# Altium schematic sheet Board.SchDoc: SLEFIE_ON_BOARD_COMPUTER
size A2
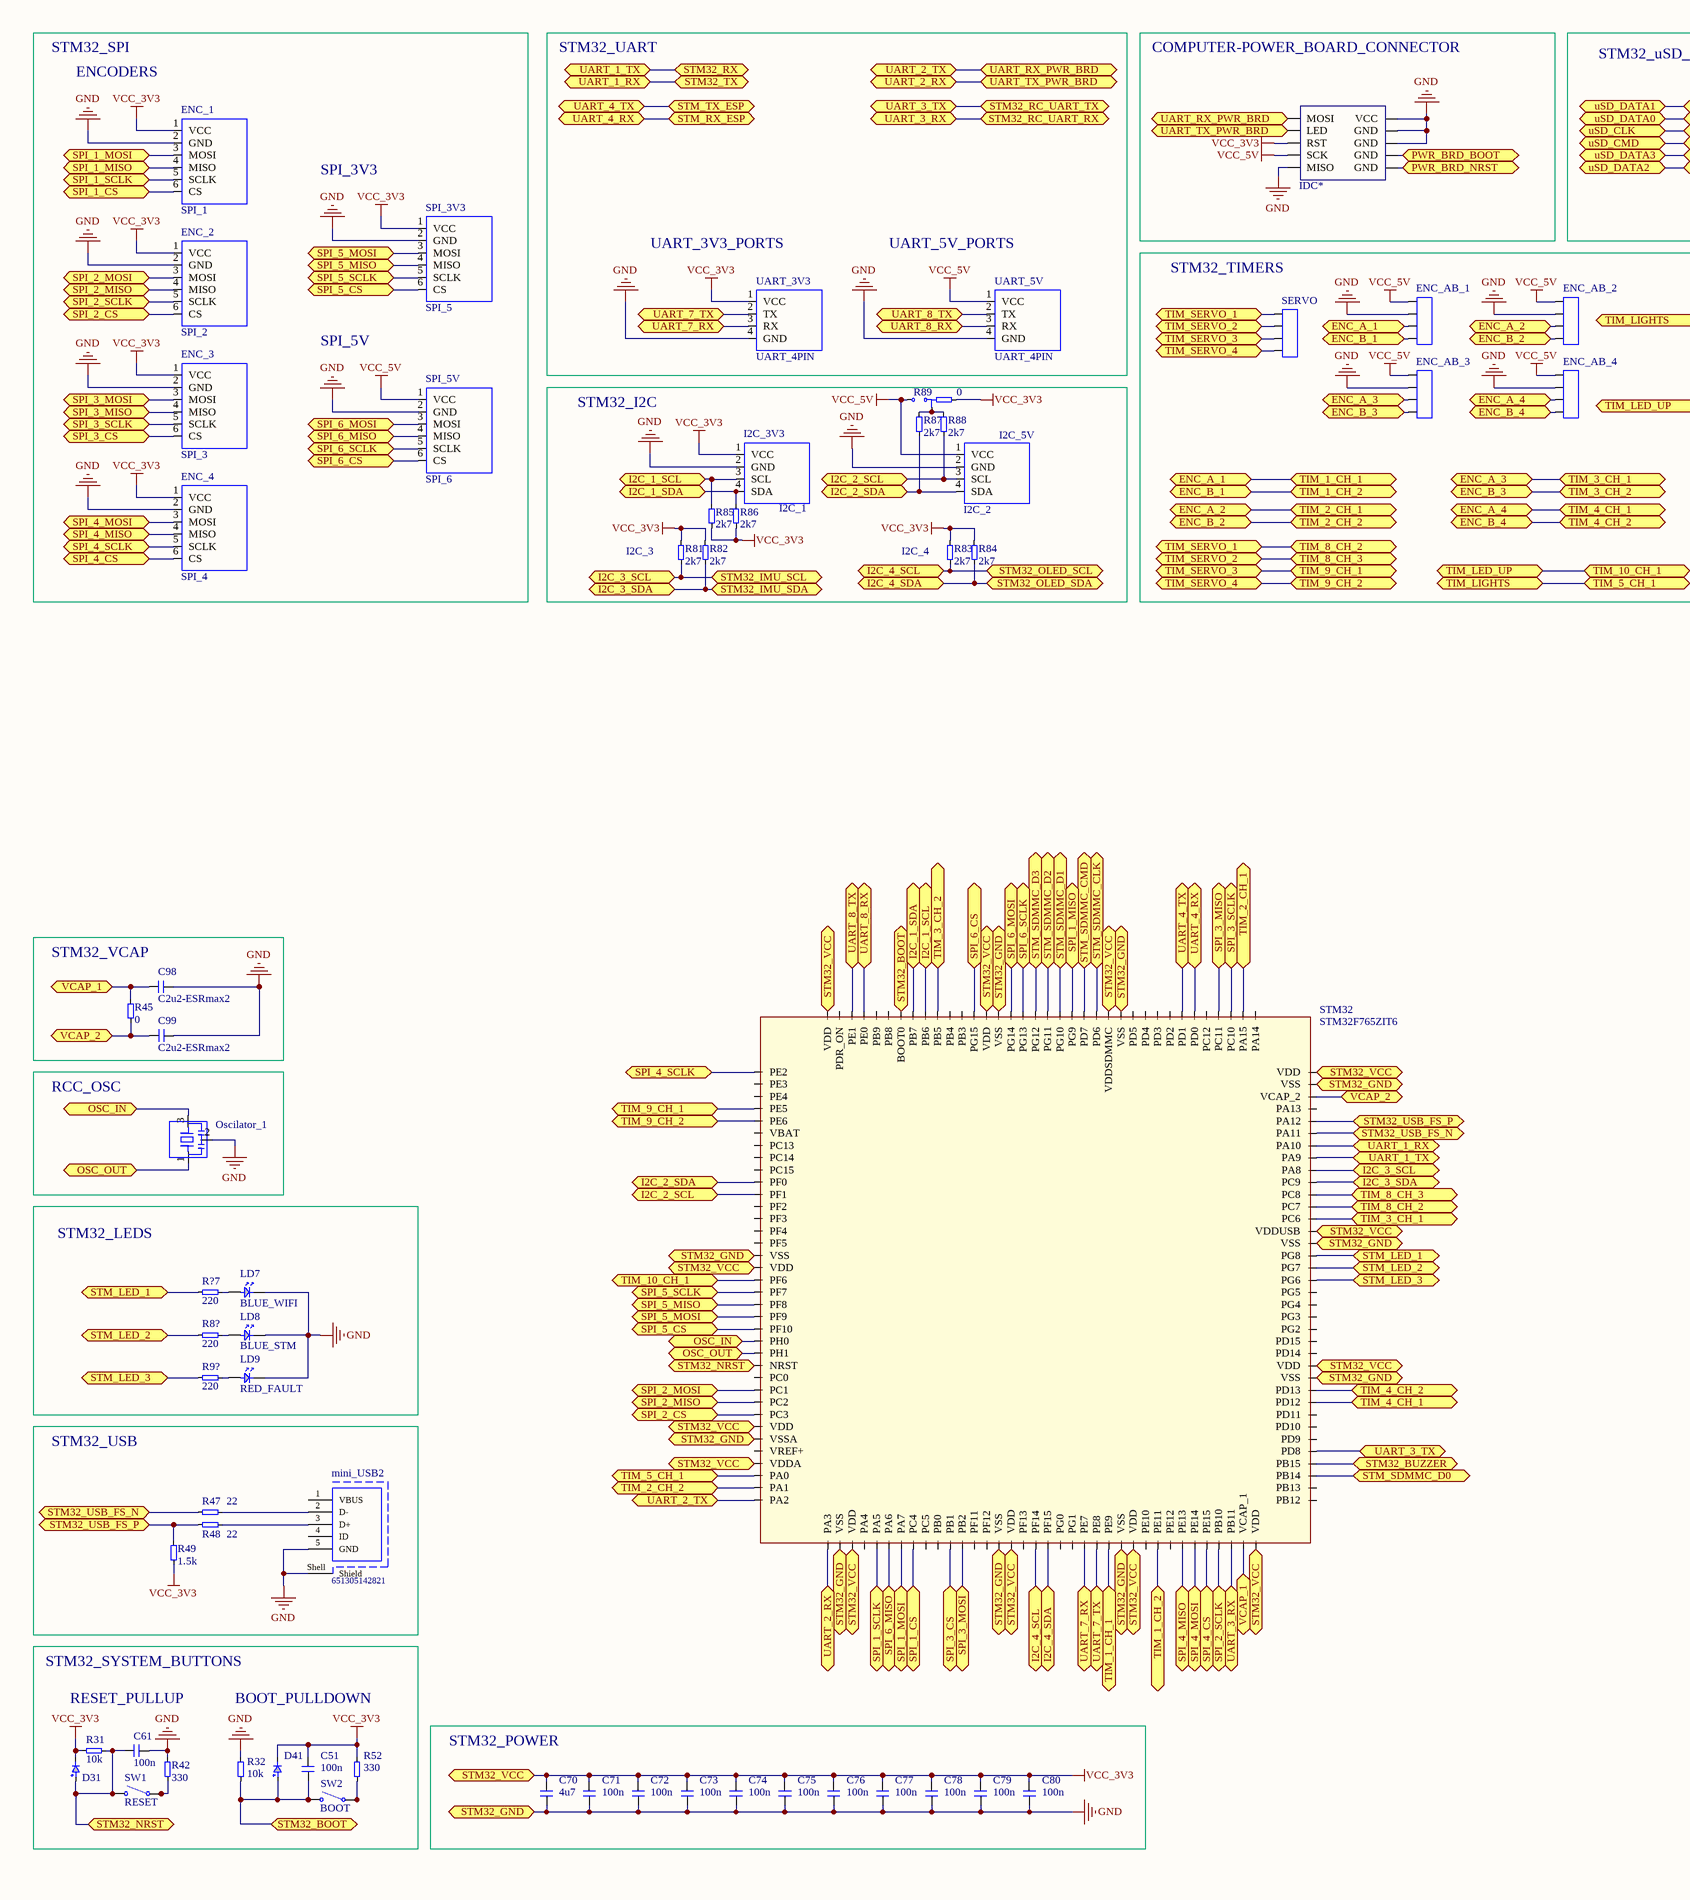
[diagram p0: Board.SchDoc, left]
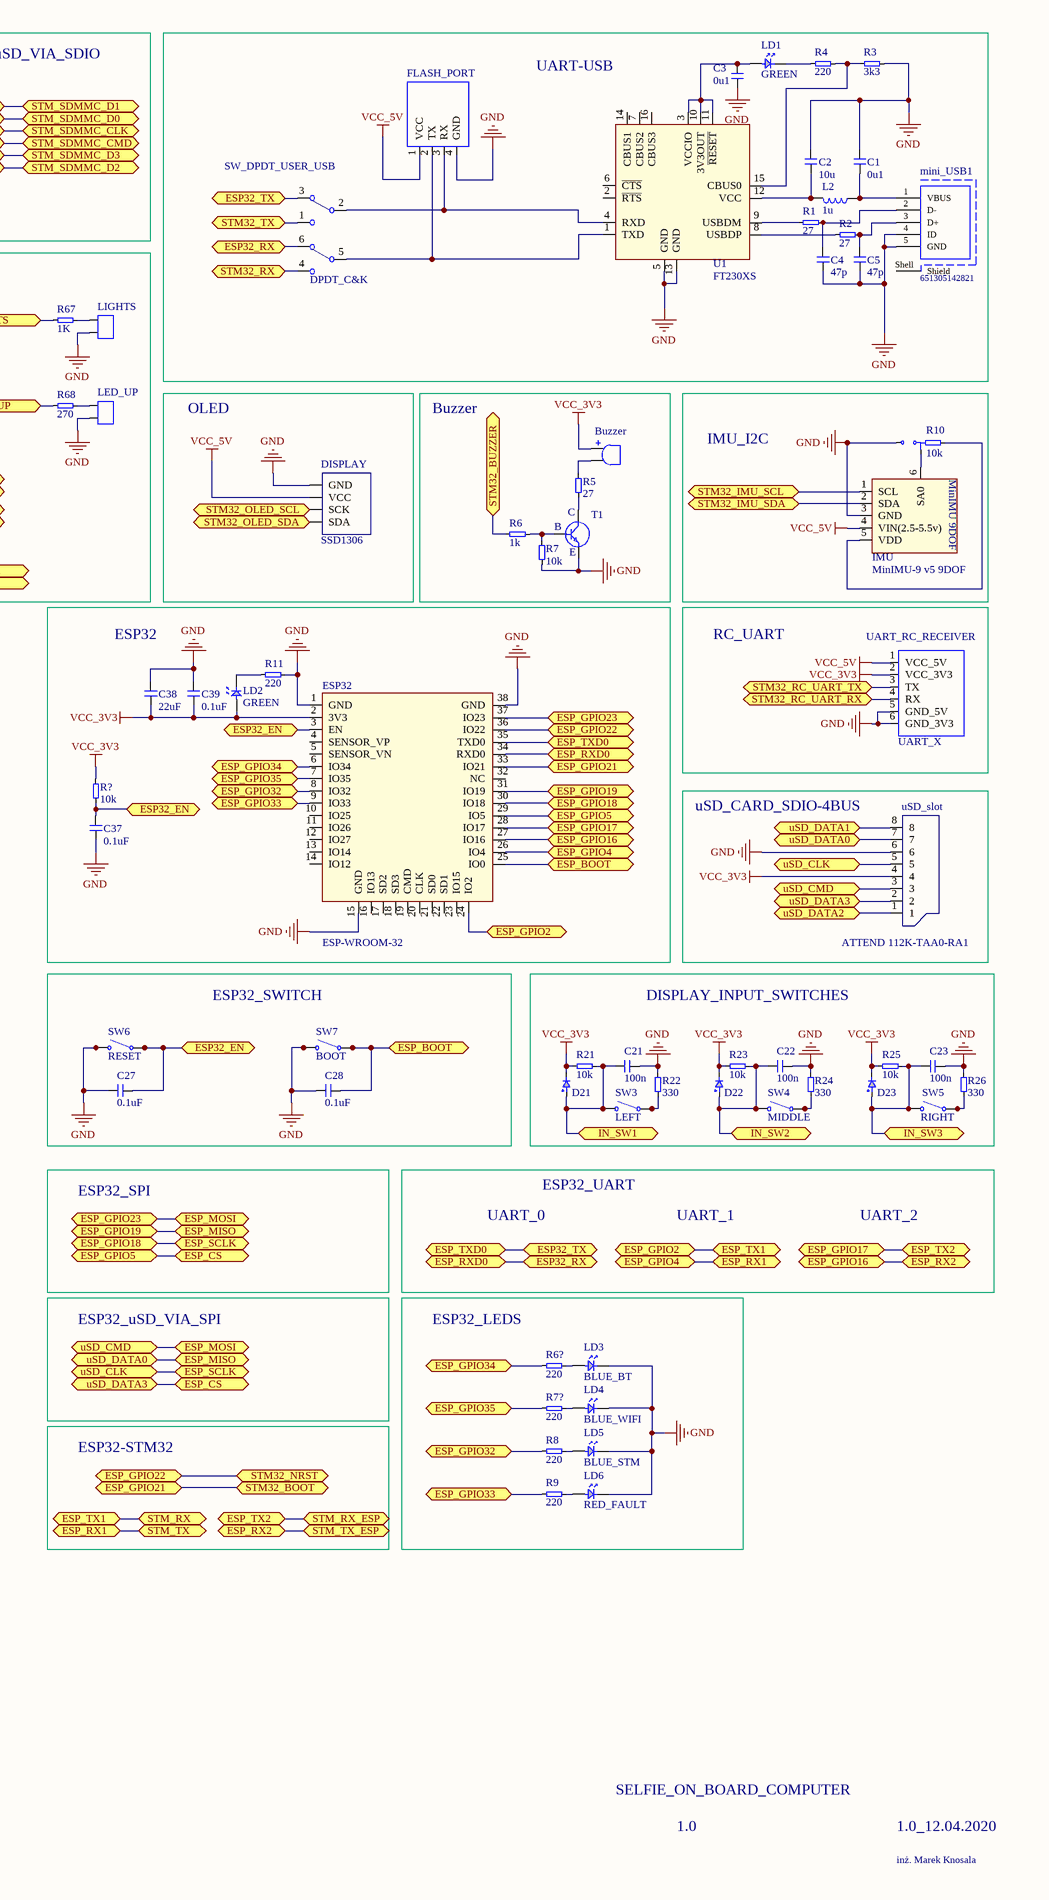
[diagram p1: Board.SchDoc, right]

## Parts
Buzzer  magnectic_buzzer  [SMT-0540-S-R]  (value not drawn)
C1  0u1  [0603]
C2  10u  [0603]
C3  0u1  [0603]
C4  47p  [0603]
C5  47p  [0603]
C21  100n  [0603]
C22  100n  [0603]
C23  100n  [0603]
C27  0.1uF  [0603]
C28  0.1uF  [0603]
C37  0.1uF  [0603]
C38  22uF  [0603]
C39  0.1uF  [0603]
C51  100n  [0603]
C61  100n  [0603]
C70  4u7  [0603]
C71  100n  [0603]
C72  100n  [0603]
C73  100n  [0603]
C74  100n  [0603]
C75  100n  [0603]
C76  100n  [0603]
C77  100n  [0603]
C78  100n  [0603]
C79  100n  [0603]
C80  100n  [0603]
C98  C2u2-ESRmax2  [0603]
C99  C2u2-ESRmax2  [0603]
D21  diode  [SOD123]  (value not drawn)
D22  diode  [SOD123]  (value not drawn)
D23  diode  [SOD123]  (value not drawn)
D31  diode  [SOD123]  (value not drawn)
D41  diode  [SOD123]  (value not drawn)
DISPLAY  SSD1306  [SSD1306]
ENC_1  SPI_1  [JST SR SH 1.0 - 6PIN]
ENC_2  SPI_2  [JST SR SH 1.0 - 6PIN]
ENC_3  SPI_3  [JST SR SH 1.0 - 6PIN]
ENC_4  SPI_4  [JST SR SH 1.0 - 6PIN]
ENC_AB_1  4 PIN CONNECTOR  [JST SR SH 1.0 - 4PIN]  (value not drawn)
ENC_AB_2  4 PIN CONNECTOR  [JST SR SH 1.0 - 4PIN]  (value not drawn)
ENC_AB_3  4 PIN CONNECTOR  [JST SR SH 1.0 - 4PIN]  (value not drawn)
ENC_AB_4  4 PIN CONNECTOR  [JST SR SH 1.0 - 4PIN]  (value not drawn)
ESP32  ESP-WROOM-32  [ESP-WROOM-32]
FLASH_PORT  UART_1  [JST SR SH 1.0 TOP - 4PIN]  (value not drawn)
I2C_3V3  I2C_1  [JST SR SH 1.0 - 4PIN]
I2C_5V  I2C_2  [JST SR SH 1.0 - 4PIN]
IDC*  IDC  [IDC_10_1.27]  (value not drawn)
IMU  MinIMU-9 v5 9DOF  [MinIMU-9 v5 9DOF - GOLDPINS]
L2  1u  [R0603]
LD1  GREEN  [0603]
LD2  GREEN  [0603]
LD3  BLUE_BT  [0603]
LD4  BLUE_WIFI  [0603]
LD5  BLUE_STM  [0603]
LD6  RED_FAULT  [0603]
LD7  BLUE_WIFI  [0603]
LD8  BLUE_STM  [0603]
LD9  RED_FAULT  [0603]
LED_UP  2 PIN CONNECTOR  [JST SR SH 1.0 - 2pin]  (value not drawn)
LIGHTS  2 PIN CONNECTOR  [JST SR SH 1.0 - 2pin]  (value not drawn)
mini_USB1  651305142821  [651305142821]
mini_USB2  651305142821  [651305142821]
Oscilator_1  CSTCC8M00G53-R0  [CSTCC8M00G53-R0]  (value not drawn)
R1  27  [R0603]
R2  27  [R0603]
R3  3k3  [R0603]
R4  220  [R0603]
R5  27  [R0603]
R6  1k  [R0603]
R6?  220  [R0603]
R7  10k  [R0603]
R7?  220  [R0603]
R8  220  [R0603]
R8?  220  [R0603]
R9  220  [R0603]
R9?  220  [R0603]
R10  10k  [R0603 - double]
R11  220  [R0603]
R21  10k  [R0603]
R22  330  [R0603]
R23  10k  [R0603]
R24  330  [R0603]
R25  10k  [R0603]
R26  330  [R0603]
R31  10k  [R0603]
R32  10k  [R0603]
R42  330  [R0603]
R45  0  [R0603]
R47  22  [R0603]
R48  22  [R0603]
R49  1.5k  [R0603]
R52  330  [R0603]
R67  1K  [R0603]
R68  270  [R0603]
R81  2k7  [R0603]
R82  2k7  [R0603]
R83  2k7  [R0603]
R84  2k7  [R0603]
R85  2k7  [R0603]
R86  2k7  [R0603]
R87  2k7  [R0603]
R88  2k7  [R0603]
R89  0  [R0603 - double]
R?  10k  [R0603]
R?7  220  [R0603]
SERVO  TIMERS  [JST SR SH 1.0 - 4PIN]  (value not drawn)
SPI_3V3  SPI_5  [JST SR SH 1.0 - 6PIN]
SPI_5V  SPI_6  [JST SR SH 1.0 - 6PIN]
STM32  STM32F765ZIT6  [LQFP144]
SW1  RESET  [LSH Gullwing]
SW2  BOOT  [LSH Gullwing]
SW3  LEFT  [LSH Gullwing]
SW4  MIDDLE  [LSH Gullwing]
SW5  RIGHT  [LSH Gullwing]
SW6  RESET  [LSH Gullwing]
SW7  BOOT  [LSH Gullwing]
SW_DPDT_USER_USB  DPDT_C&K  [JS202011SCQN_C&K]
T1  NPN  [SOT23]  (value not drawn)
U1  FT230XS  [SSOP16]
UART_3V3  UART_4PIN  [JST SR SH 1.0 - 4PIN]
UART_5V  UART_4PIN  [JST SR SH 1.0 - 4PIN]
UART_RC_RECEIVER  UART_X  [JST SR SH 1.0 - 6PIN]
uSD_slot  ATTEND 112K-TAA0-RA1  [ATTEND 112K-TAA0-RA1]

## Blocks framed on the sheet
COMPUTER-POWER_BOARD_CONNECTOR: IDC*
UART-USB: C1-C5 FLASH_PORT L2 LD1 mini_USB1 R1-R4 SW_DPDT_USER_USB U1
STM32_TIMERS: ENC_AB_1-ENC_AB_4 LED_UP LIGHTS R67 R68 SERVO
STM32_I2C: I2C_3V3 I2C_5V R81-R89
OLED: DISPLAY
Buzzer: Buzzer R5-R7 T1
IMU_I2C: IMU R10
ESP32: C37-C39 ESP32 LD2 R11 R?
RC_UART: UART_RC_RECEIVER
uSD_CARD_SDIO-4BUS: uSD_slot
STM32_VCAP: C98 C99 R45
ESP32_SWITCH: C27 C28 SW6 SW7
DISPLAY_INPUT_SWITCHES: C21-C23 D21-D23 R21-R26 SW3-SW5
RCC_OSC: Oscilator_1
STM32_LEDS: LD7-LD9 R8? R9? R?7
ESP32_LEDS: LD3-LD6 R6? R7? R8 R9
STM32_USB: mini_USB2 R47-R49
STM32_POWER: C70-C80

## Ports
ENC_A_1, ENC_A_2, ENC_A_3, ENC_A_4, ENC_B_1, ENC_B_2, ENC_B_3, ENC_B_4, ESP32_EN, ESP32_RX, ESP32_TX, ESP_BOOT, ESP_CS, ESP_GPIO2, ESP_GPIO4, ESP_GPIO5, ESP_GPIO16, ESP_GPIO17, ESP_GPIO18, ESP_GPIO19, ESP_GPIO21, ESP_GPIO22, ESP_GPIO23, ESP_GPIO32, ESP_GPIO33, ESP_GPIO34, ESP_GPIO35, ESP_MISO, ESP_MOSI, ESP_RX1, ESP_RX2, ESP_RXD0, ESP_SCLK, ESP_TX1, ESP_TX2, ESP_TXD0, I2C_1_SCL, I2C_1_SDA, I2C_2_SCL, I2C_2_SDA, I2C_3_SCL, I2C_3_SDA, I2C_4_SCL, I2C_4_SDA, IN_SW1, IN_SW2, IN_SW3, OSC_IN, OSC_OUT, PWR_BRD_BOOT, PWR_BRD_NRST, SPI_1_CS, SPI_1_MISO, SPI_1_MOSI, SPI_1_SCLK, SPI_2_CS, SPI_2_MISO, SPI_2_MOSI, SPI_2_SCLK, SPI_3_CS, SPI_3_MISO, SPI_3_MOSI, SPI_3_SCLK, SPI_4_CS, SPI_4_MISO, SPI_4_MOSI, SPI_4_SCLK, SPI_5_CS, SPI_5_MISO, SPI_5_MOSI, SPI_5_SCLK, SPI_6_CS, SPI_6_MISO, SPI_6_MOSI, SPI_6_SCLK, STM32_BOOT, STM32_BUZZER, STM32_GND, STM32_IMU_SCL, STM32_IMU_SDA, STM32_NRST, STM32_OLED_SCL, STM32_OLED_SDA, STM32_RC_UART_RX, STM32_RC_UART_TX, STM32_RX, STM32_TX, STM32_USB_FS_N, STM32_USB_FS_P, STM32_VCC, STM_LED_1, STM_LED_2, STM_LED_3, STM_RX, STM_RX_ESP, STM_SDMMC_CLK, STM_SDMMC_CMD, STM_SDMMC_D0, STM_SDMMC_D1, STM_SDMMC_D2, STM_SDMMC_D3, STM_TX, STM_TX_ESP, TIM_1_CH_1, TIM_1_CH_2, TIM_2_CH_1, TIM_2_CH_2, TIM_3_CH_1, TIM_3_CH_2, TIM_4_CH_1, TIM_4_CH_2, TIM_5_CH_1, TIM_8_CH_2, TIM_8_CH_3, TIM_9_CH_1, TIM_9_CH_2, TIM_10_CH_1, TIM_LED_UP, TIM_LIGHTS, TIM_SERVO_1, TIM_SERVO_2, TIM_SERVO_3, TIM_SERVO_4, UART_1_RX, UART_1_TX, UART_2_RX, UART_2_TX, UART_3_RX, UART_3_TX, UART_4_RX, UART_4_TX, UART_7_RX, UART_7_TX, UART_8_RX, UART_8_TX, UART_RX_PWR_BRD, UART_TX_PWR_BRD, uSD_CLK, uSD_CMD, uSD_DATA0, uSD_DATA1, uSD_DATA2, uSD_DATA3, VCAP_1, VCAP_2

## Nets
GND: C1.1 C2.1 C3.2 C4.2 C5.2 C21.2 C22.2 C23.2 C27.2 C28.2 C37.2 C38.1 C39.1 C61.2 C70.1 C71.1 C72.1 C73.1 C74.1 C75.1 C76.1 C77.1 C78.1 C79.1 C80.1 C98.2 C99.1 DISPLAY.1(GND) ENC_1.2(GND) ENC_2.2(GND) ENC_3.2(GND) ENC_4.2(GND) ENC_AB_1.2 ENC_AB_2.2 ENC_AB_3.2 ENC_AB_4.2 ESP32.1(GND) ESP32.15(GND) ESP32.38(GND) FLASH_PORT.4(GND) I2C_3V3.2(GND) I2C_5V.2(GND) IDC*.2(VCC) IDC*.4(GND) IDC*.6(GND) IDC*.9(MISO) IMU.3(GND) LD3.2 LD4.2 LD5.2 LD6.2 LD7.2 LD8.2 LD9.2 LED_UP.2 LIGHTS.2 mini_USB1.4(ID) mini_USB1.5(GND) mini_USB2.5(GND) mini_USB2.Shell(Shield) Oscilator_1.2 R3.2 R7.1 R10.3 R11.2 R22.1 R24.1 R26.1 R32.1 R42.1 SPI_3V3.2(GND) SPI_5V.2(GND) STM32.16(VSS) STM32.31(VSSA) STM32.38(VSS) STM32.51(VSS) STM32.61(VSS) STM32.83(VSS) STM32.94(VSS) STM32.107(VSS) STM32.120(VSS) STM32.130(VSS) SW6.1 SW6.2 SW7.1 SW7.2 T1.3 U1.5(GND) U1.13(GND) UART_3V3.4(GND) UART_5V.4(GND) UART_RC_RECEIVER.5(GND_5V) UART_RC_RECEIVER.6(GND_3V3) uSD_slot.6 ; port STM32_GND
VCC_3V3: Buzzer.2 C38.2 C39.2 C51.2 C70.2 C71.2 C72.2 C73.2 C74.2 C75.2 C76.2 C77.2 C78.2 C79.2 C80.2 D21.2 D22.2 D23.2 D31.2 D41.2 ENC_1.1(VCC) ENC_2.1(VCC) ENC_3.1(VCC) ENC_4.1(VCC) ESP32.2(3V3) I2C_3V3.1(VCC) IDC*.5(RST) LD2.1 R21.2 R23.2 R25.2 R31.2 R49.1 R52.1 R81.2 R82.2 R83.2 R84.2 R85.2 R86.2 R89.1 R?.2 SPI_3V3.1(VCC) STM32.17(VDD) STM32.30(VDD) STM32.33(VDDA) STM32.39(VDD) STM32.52(VDD) STM32.62(VDD) STM32.72(VDD) STM32.84(VDD) STM32.95(VDDUSB) STM32.108(VDD) STM32.121(VDDSDMMC) STM32.131(VDD) STM32.144(VDD) UART_3V3.1(VCC) UART_RC_RECEIVER.2(VCC_3V3) uSD_slot.4 ; port STM32_VCC
VCC_5V: DISPLAY.2(VCC) ENC_AB_1.1 ENC_AB_2.1 ENC_AB_3.1 ENC_AB_4.1 FLASH_PORT.1(VCC) I2C_5V.1(VCC) IDC*.7(SCK) IMU.4(VIN(2.5-5.5v)) R89.3 SPI_5V.1(VCC) UART_5V.1(VCC) UART_RC_RECEIVER.1(VCC_5V)
ENC_A_1: ENC_AB_1.3 STM32.60(PE9) ; port ENC_A_1, port TIM_1_CH_1
ENC_A_2: ENC_AB_2.3 STM32.110(PA15) ; port ENC_A_2, port TIM_2_CH_1
ENC_A_3: ENC_AB_3.3 STM32.96(PC6) ; port ENC_A_3, port TIM_3_CH_1
ENC_A_4: ENC_AB_4.3 STM32.81(PD12) ; port ENC_A_4, port TIM_4_CH_1
ENC_B_1: ENC_AB_1.4 STM32.64(PE11) ; port ENC_B_1, port TIM_1_CH_2
ENC_B_2: ENC_AB_2.4 STM32.35(PA1) ; port ENC_B_2, port TIM_2_CH_2
ENC_B_3: ENC_AB_3.4 STM32.135(PB5) ; port ENC_B_3, port TIM_3_CH_2
ENC_B_4: ENC_AB_4.4 STM32.82(PD13) ; port ENC_B_4, port TIM_4_CH_2
ESP32_EN: C27.1 C37.1 ESP32.3(EN) R?.1 SW6.3 SW6.4 ; port ESP32_EN
ESP32_RX: ESP32.34(RXD0) SW_DPDT_USER_USB.6 ; port ESP32_RX, port ESP_RXD0
ESP32_TX: ESP32.35(TXD0) SW_DPDT_USER_USB.3 ; port ESP32_TX, port ESP_TXD0
ESP_BOOT: C28.1 ESP32.25(IO0) SW7.3 SW7.4 ; port ESP_BOOT
ESP_CS: ESP32.29(IO5) STM32.127(PG12) uSD_slot.2 ; port uSD_DATA3, port ESP_CS, port ESP_GPIO5, port STM_SDMMC_D3
ESP_GPIO2: ESP32.24(IO2) ; port ESP_GPIO2, port ESP_TX1, port STM_RX
ESP_GPIO4: ESP32.26(IO4) ; port ESP_GPIO4, port ESP_RX1, port STM_TX
ESP_GPIO16: ESP32.27(IO16) STM32.115(PD1) ; port ESP_RX2, port ESP_GPIO16, port STM_TX_ESP, port UART_4_TX
ESP_GPIO17: ESP32.28(IO17) STM32.114(PD0) ; port ESP_TX2, port ESP_GPIO17, port STM_RX_ESP, port UART_4_RX
ESP_GPIO18: ESP32.30(IO18) STM32.122(PD6) uSD_slot.5 ; port uSD_CLK, port ESP_SCLK, port ESP_GPIO18, port STM_SDMMC_CLK
ESP_GPIO19: ESP32.31(IO19) STM32.75(PB14) uSD_slot.7 ; port uSD_DATA0, port ESP_MISO, port ESP_GPIO19, port STM_SDMMC_D0
ESP_GPIO21: C51.1 D41.1 ESP32.33(IO21) R32.2 STM32.138(BOOT0) SW2.1 SW2.2 ; port STM32_BOOT, port ESP_GPIO21
ESP_GPIO22: C61.1 D31.1 ESP32.36(IO22) R31.1 STM32.25(NRST) SW1.1 SW1.2 ; port ESP_GPIO22, port STM32_NRST
ESP_GPIO23: ESP32.37(IO23) STM32.123(PD7) uSD_slot.3 ; port uSD_CMD, port ESP_MOSI, port ESP_GPIO23, port STM_SDMMC_CMD
ESP_GPIO32: ESP32.8(IO32) R8.1 ; port ESP_GPIO32
ESP_GPIO33: ESP32.9(IO33) R9.1 ; port ESP_GPIO33
ESP_GPIO34: ESP32.6(IO34) R6?.1 ; port ESP_GPIO34
ESP_GPIO35: ESP32.7(IO35) R7?.1 ; port ESP_GPIO35
I2C_1_SCL: I2C_3V3.3(SCL) R85.1 STM32.136(PB6) ; port I2C_1_SCL
I2C_1_SDA: I2C_3V3.4(SDA) R86.1 STM32.137(PB7) ; port I2C_1_SDA
I2C_2_SCL: I2C_5V.3(SCL) R88.1 STM32.11(PF1) ; port I2C_2_SCL
I2C_2_SDA: I2C_5V.4(SDA) R87.1 STM32.10(PF0) ; port I2C_2_SDA
I2C_3_SCL: IMU.1(SCL) R81.1 STM32.100(PA8) ; port STM32_IMU_SCL, port I2C_3_SCL
I2C_3_SDA: IMU.2(SDA) R82.1 STM32.99(PC9) ; port STM32_IMU_SDA, port I2C_3_SDA
I2C_4_SCL: DISPLAY.3(SCK) R83.1 STM32.54(PF14) ; port STM32_OLED_SCL, port I2C_4_SCL
I2C_4_SDA: DISPLAY.4(SDA) R84.1 STM32.55(PF15) ; port STM32_OLED_SDA, port I2C_4_SDA
IN_SW1: C21.1 D21.1 R21.1 SW3.1 SW3.2 ; port IN_SW1
IN_SW2: C22.1 D22.1 R23.1 SW4.1 SW4.2 ; port IN_SW2
IN_SW3: C23.1 D23.1 R25.1 SW5.1 SW5.2 ; port IN_SW3
OSC_IN: Oscilator_1.3 STM32.23(PH0) ; port OSC_IN
OSC_OUT: Oscilator_1.1 STM32.24(PH1) ; port OSC_OUT
PWR_BRD_BOOT: IDC*.8(GND) ; port PWR_BRD_BOOT
PWR_BRD_NRST: IDC*.10(GND) ; port PWR_BRD_NRST
SPI_1_CS: ENC_1.6(CS) STM32.44(PC4) ; port SPI_1_CS
SPI_1_MISO: ENC_1.4(MISO) STM32.124(PG9) ; port SPI_1_MISO
SPI_1_MOSI: ENC_1.3(MOSI) STM32.43(PA7) ; port SPI_1_MOSI
SPI_1_SCLK: ENC_1.5(SCLK) STM32.41(PA5) ; port SPI_1_SCLK
SPI_2_CS: ENC_2.6(CS) STM32.29(PC3) ; port SPI_2_CS
SPI_2_MISO: ENC_2.4(MISO) STM32.28(PC2) ; port SPI_2_MISO
SPI_2_MOSI: ENC_2.3(MOSI) STM32.27(PC1) ; port SPI_2_MOSI
SPI_2_SCLK: ENC_2.5(SCLK) STM32.69(PB10) ; port SPI_2_SCLK
SPI_3_CS: ENC_3.6(CS) STM32.47(PB1) ; port SPI_3_CS
SPI_3_MISO: ENC_3.4(MISO) STM32.112(PC11) ; port SPI_3_MISO
SPI_3_MOSI: ENC_3.3(MOSI) STM32.48(PB2) ; port SPI_3_MOSI
SPI_3_SCLK: ENC_3.5(SCLK) STM32.111(PC10) ; port SPI_3_SCLK
SPI_4_CS: ENC_4.6(CS) STM32.68(PE15) ; port SPI_4_CS
SPI_4_MISO: ENC_4.4(MISO) STM32.66(PE13) ; port SPI_4_MISO
SPI_4_MOSI: ENC_4.3(MOSI) STM32.67(PE14) ; port SPI_4_MOSI
SPI_4_SCLK: ENC_4.5(SCLK) STM32.1(PE2) ; port SPI_4_SCLK
SPI_5_CS: SPI_3V3.6(CS) STM32.22(PF10) ; port SPI_5_CS
SPI_5_MISO: SPI_3V3.4(MISO) STM32.20(PF8) ; port SPI_5_MISO
SPI_5_MOSI: SPI_3V3.3(MOSI) STM32.21(PF9) ; port SPI_5_MOSI
SPI_5_SCLK: SPI_3V3.5(SCLK) STM32.19(PF7) ; port SPI_5_SCLK
SPI_6_CS: SPI_5V.6(CS) STM32.132(PG15) ; port SPI_6_CS
SPI_6_MISO: SPI_5V.4(MISO) STM32.42(PA6) ; port SPI_6_MISO
SPI_6_MOSI: SPI_5V.3(MOSI) STM32.129(PG14) ; port SPI_6_MOSI
SPI_6_SCLK: SPI_5V.5(SCLK) STM32.128(PG13) ; port SPI_6_SCLK
STM32_BUZZER: R6.1 STM32.76(PB15) ; port STM32_BUZZER
STM32_RC_UART_RX: STM32.70(PB11) UART_RC_RECEIVER.4(RX) ; port STM32_RC_UART_RX, port UART_3_RX
STM32_RC_UART_TX: STM32.77(PD8) UART_RC_RECEIVER.3(TX) ; port STM32_RC_UART_TX, port UART_3_TX
STM32_RX: STM32.101(PA9) SW_DPDT_USER_USB.4 ; port STM32_RX, port UART_1_TX
STM32_TX: STM32.102(PA10) SW_DPDT_USER_USB.1 ; port STM32_TX, port UART_1_RX
STM32_USB_FS_N: R47.1 STM32.103(PA11) ; port STM32_USB_FS_N
STM32_USB_FS_P: R48.1 R49.2 STM32.104(PA12) ; port STM32_USB_FS_P
STM_LED_1: R?7.1 STM32.93(PG8) ; port STM_LED_1
STM_LED_2: R8?.1 STM32.92(PG7) ; port STM_LED_2
STM_LED_3: R9?.1 STM32.91(PG6) ; port STM_LED_3
STM_SDMMC_D1: STM32.125(PG10) uSD_slot.8 ; port uSD_DATA1, port STM_SDMMC_D1
STM_SDMMC_D2: STM32.126(PG11) uSD_slot.1 ; port uSD_DATA2, port STM_SDMMC_D2
TIM_5_CH_1: R67.1 STM32.34(PA0) ; port TIM_LIGHTS, port TIM_5_CH_1
TIM_8_CH_2: SERVO.1 STM32.97(PC7) ; port TIM_SERVO_1, port TIM_8_CH_2
TIM_8_CH_3: SERVO.2 STM32.98(PC8) ; port TIM_SERVO_2, port TIM_8_CH_3
TIM_9_CH_1: SERVO.3 STM32.4(PE5) ; port TIM_SERVO_3, port TIM_9_CH_1
TIM_9_CH_2: SERVO.4 STM32.5(PE6) ; port TIM_SERVO_4, port TIM_9_CH_2
TIM_10_CH_1: R68.1 STM32.18(PF6) ; port TIM_LED_UP, port TIM_10_CH_1
UART_2_RX: IDC*.3(LED) STM32.37(PA3) ; port UART_TX_PWR_BRD, port UART_2_RX
UART_2_TX: IDC*.1(MOSI) STM32.36(PA2) ; port UART_RX_PWR_BRD, port UART_2_TX
UART_7_RX: STM32.58(PE7) UART_3V3.3(RX) ; port UART_7_RX
UART_7_TX: STM32.59(PE8) UART_3V3.2(TX) ; port UART_7_TX
UART_8_RX: STM32.141(PE0) UART_5V.3(RX) ; port UART_8_RX
UART_8_TX: STM32.142(PE1) UART_5V.2(TX) ; port UART_8_TX
VCAP_1: C98.1 R45.2 STM32.71(VCAP_1) ; port VCAP_1
VCAP_2: C99.2 R45.1 STM32.106(VCAP_2) ; port VCAP_2
NetBuzzer_1: Buzzer.1 R5.1
NetC1_2: C1.2 L2.1 mini_USB1.1(VBUS)
NetC2_2: C2.2 L2.2 U1.12(VCC)
NetC3_1: C3.1 LD1.1 U1.3(VCCIO) U1.10(3V3OUT) U1.11(~{RESET})
NetC4_1: C4.1 mini_USB1.2(D-) R1.2
NetC5_1: C5.1 mini_USB1.3(D+) R2.2
NetFLASH_PORT_2: FLASH_PORT.2(TX) SW_DPDT_USER_USB.5 U1.1(TXD)
NetFLASH_PORT_3: FLASH_PORT.3(RX) SW_DPDT_USER_USB.2 U1.4(RXD)
NetIMU_5: IMU.5(VDD) R10.1
NetIMU_6: IMU.6(SA0) R10.2
NetLD1_2: LD1.2 R4.1
NetLD2_2: LD2.2 R11.1
NetLD3_1: LD3.1 R6?.2
NetLD4_1: LD4.1 R7?.2
NetLD5_1: LD5.1 R8.2
NetLD6_1: LD6.1 R9.2
NetLD7_1: LD7.1 R?7.2
NetLD8_1: LD8.1 R8?.2
NetLD9_1: LD9.1 R9?.2
NetLED_UP_1: LED_UP.1 R68.2
NetLIGHTS_1: LIGHTS.1 R67.2
Netmini_USB2_2: mini_USB2.2(D-) R47.2
Netmini_USB2_3: mini_USB2.3(D+) R48.2
NetR1_1: R1.1 U1.9(USBDM)
NetR2_1: R2.1 U1.8(USBDP)
NetR3_1: R3.1 R4.2 U1.15(CBUS0)
NetR5_2: R5.2 T1.2
NetR6_2: R6.2 R7.2 T1.1
NetR22_2: R22.2 SW3.3 SW3.4
NetR24_2: R24.2 SW4.3 SW4.4
NetR26_2: R26.2 SW5.3 SW5.4
NetR42_2: R42.2 SW1.3 SW1.4
NetR52_2: R52.2 SW2.3 SW2.4
NetR87_2: R87.2 R88.2 R89.2

Not connected (* = marked no-connect by the designer): ESP32 4(SENSOR_VP) 5(SENSOR_VN) 10(IO25) 11(IO26) 12(IO27) 13(IO14) 14(IO12) 16(IO13) 17(SD2) 18(SD3) 19(CMD) 20(CLK) 21(SD0) 22(SD1) 23(IO15) 32(NC); mini_USB1 Shell(Shield); mini_USB2 1(VBUS) 4(ID); STM32 2(PE3) 3(PE4) 6(VBAT) 7(PC13) 8(PC14) 9(PC15) 12(PF2) 13(PF3) 14(PF4) 15(PF5) 26(PC0) 32(VREF+) 40(PA4) 45(PC5) 46(PB0) 49(PF11) 50(PF12) 53(PF13) 56(PG0) 57(PG1) 63(PE10) 65(PE12) 73(PB12) 74(PB13) 78(PD9) 79(PD10) 80(PD11) 85(PD14) 86(PD15) 87(PG2) 88(PG3) 89(PG4) 90(PG5) 105(PA13) 109(PA14) 113(PC12) 116(PD2) 117(PD3) 118(PD4) 119(PD5) 133(PB3) 134(PB4) 139(PB8) 140(PB9) 143(PDR_ON); U1 2(~{RTS}) 6(~{CTS}) 7(CBUS2) 14(CBUS1) 16(CBUS3)

## Notes on the sheet
- STM32_SPI
- ENCODERS
- STM32_UART
- STM32_uSD_VIA_SDIO
- SPI_3V3
- UART_3V3_PORTS
- UART_5V_PORTS
- SPI_5V
- (near R81) I2C_3
- (near R83) I2C_4
- ESP32_SPI
- ESP32_UART
- UART_0
- UART_1
- UART_2
- ESP32_uSD_VIA_SPI
- ESP32-STM32
- STM32_SYSTEM_BUTTONS
- RESET_PULLUP
- BOOT_PULLDOWN
- SELFIE_ON_BOARD_COMPUTER
- 1.0
- 1.0_12.04.2020
- inż. Marek Knosala
- (in symbol MinIMU-9 v5 9DOF) MinIMU 9DOF
- (in symbol NPN) C; B; E

## Library data of the parts
C1-C5 C21-C23 C27 C28 C37-C39 C51 C61 C70-C80 C98 C99 = Cap
D21-D23 D31 D41 = Rectifier_diode
ENC_1-ENC_4 SPI_3V3 SPI_5V = SPI
FLASH_PORT = UART_4PIN
I2C_3V3 I2C_5V = I2C
L2 = L
LD1-LD9 = LED
mini_USB1 mini_USB2 = 651305142821: Mini USB 2.0 Type AB Receptacle WR-COM, Horizontal, SMT, with Pads; Rated Current: 1 A; Contact Resistance: 20 mOhm; Working Voltage: 30 VAC; ComponentLink1Description: Manufacturer; ComponentLink1URL: http://www.we-online.de; ComponentLink2Description: Datasheet; ComponentLink2URL: https://katalog.we-online.de/em/datasheet/651305142821.pdf; Part Number: 651305142821; Published Date: September 2018; Publisher: Wurth Elektronik; Orientation: Horizontal; Connector Type: Mini USB 2.0 Type AB; Operating Temperature: -40 to 105 degC; Mounting Technology: SMT; Gender: Receptacle; Packaging: Tape and Reel
R1-R6 R6? R7 R7? R8 R8? R9 R9? R11 R21-R26 R31 R32 R42 R45 R47-R49 R52 R67 R68 R81-R88 R? R?7 = Res
R10 R89 = Res_2_way
SERVO = 4 PIN CONNECTOR
SW1-SW7 = Tact_Switch_Simply
U1 = FT230XS_ON_BOARD
UART_RC_RECEIVER = UART